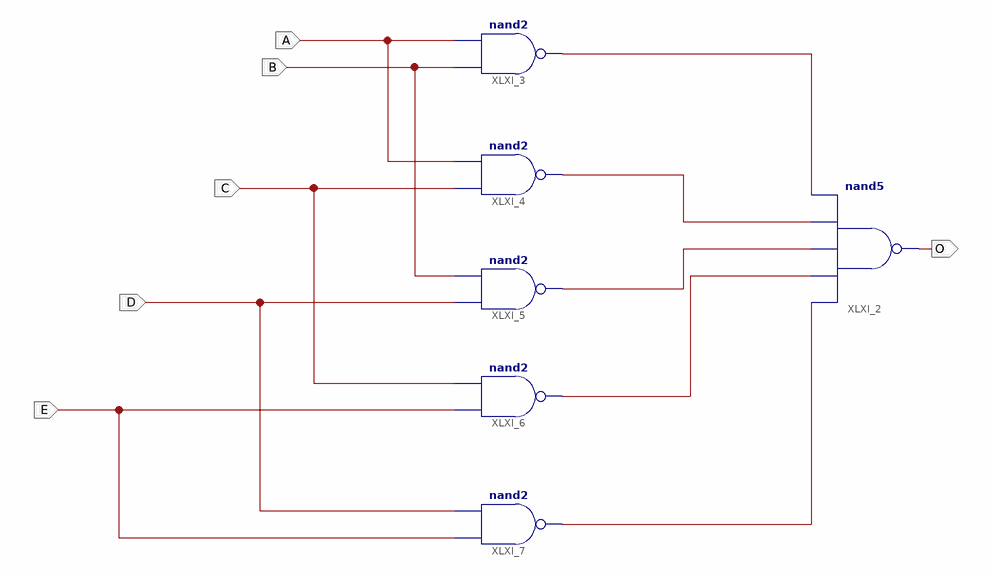
[diagram p0: schematic sheet 1]
// Xilinx ISE schematic majority_5intrari_schematic.sch (spartan3e) as structural Verilog: 6 symbols, 6 ports
module majority_5intrari_schematic (
  input  A,
  input  B,
  input  C,
  input  D,
  input  E,
  output O
);

  wire XLXN_11, XLXN_12, XLXN_13, XLXN_14, XLXN_15;

  nand XLXI_2 (O, XLXN_15, XLXN_14, XLXN_13, XLXN_12, XLXN_11);
  nand XLXI_3 (XLXN_11, B, A);
  nand XLXI_4 (XLXN_12, C, A);
  nand XLXI_5 (XLXN_13, D, B);
  nand XLXI_6 (XLXN_14, E, C);
  nand XLXI_7 (XLXN_15, E, D);
endmodule
